# Altium schematic sheet Main.SchDoc (part 1 of 2)
size A1
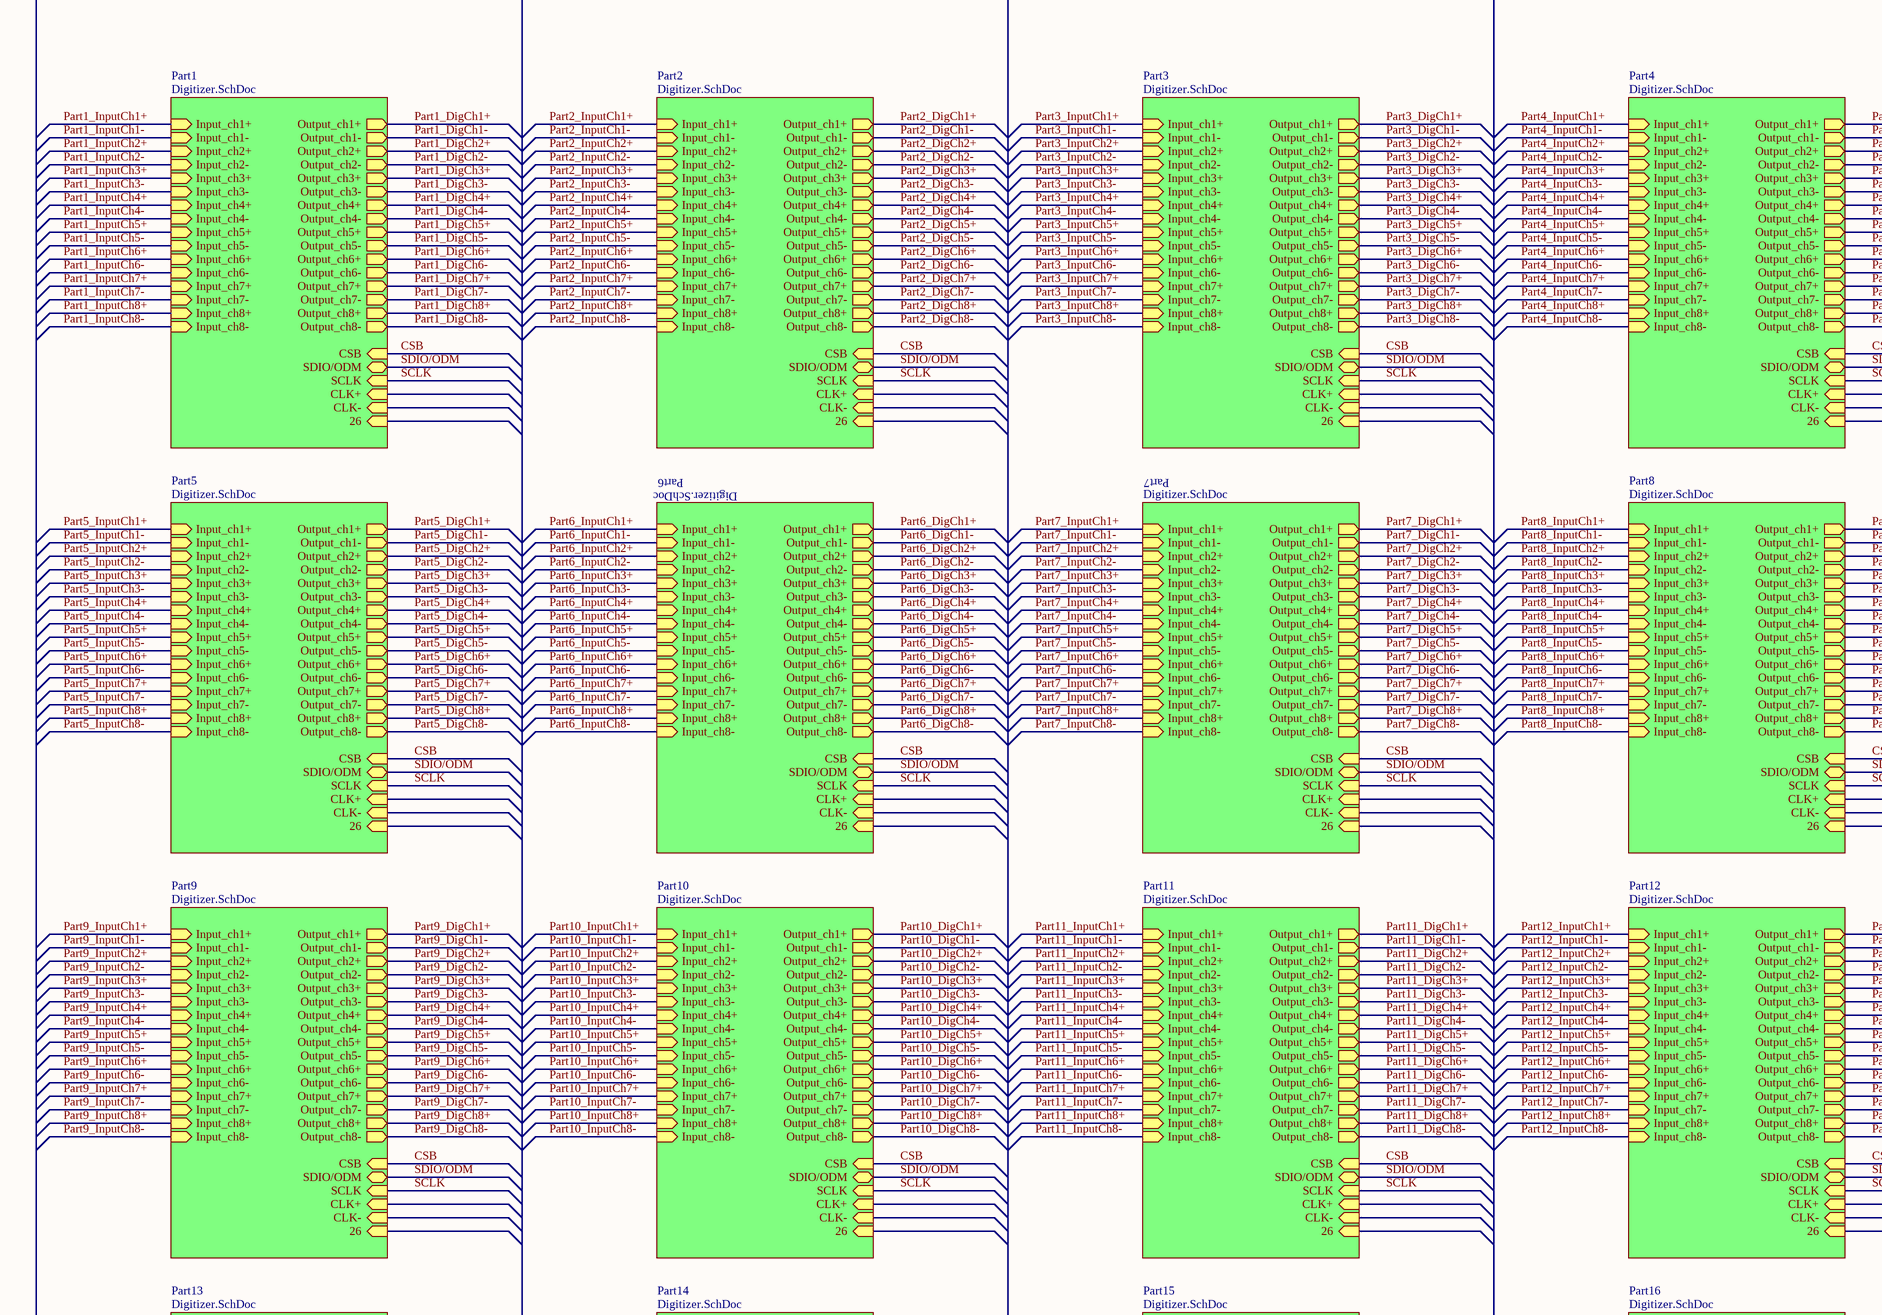
[diagram p0: Main.SchDoc, top left]
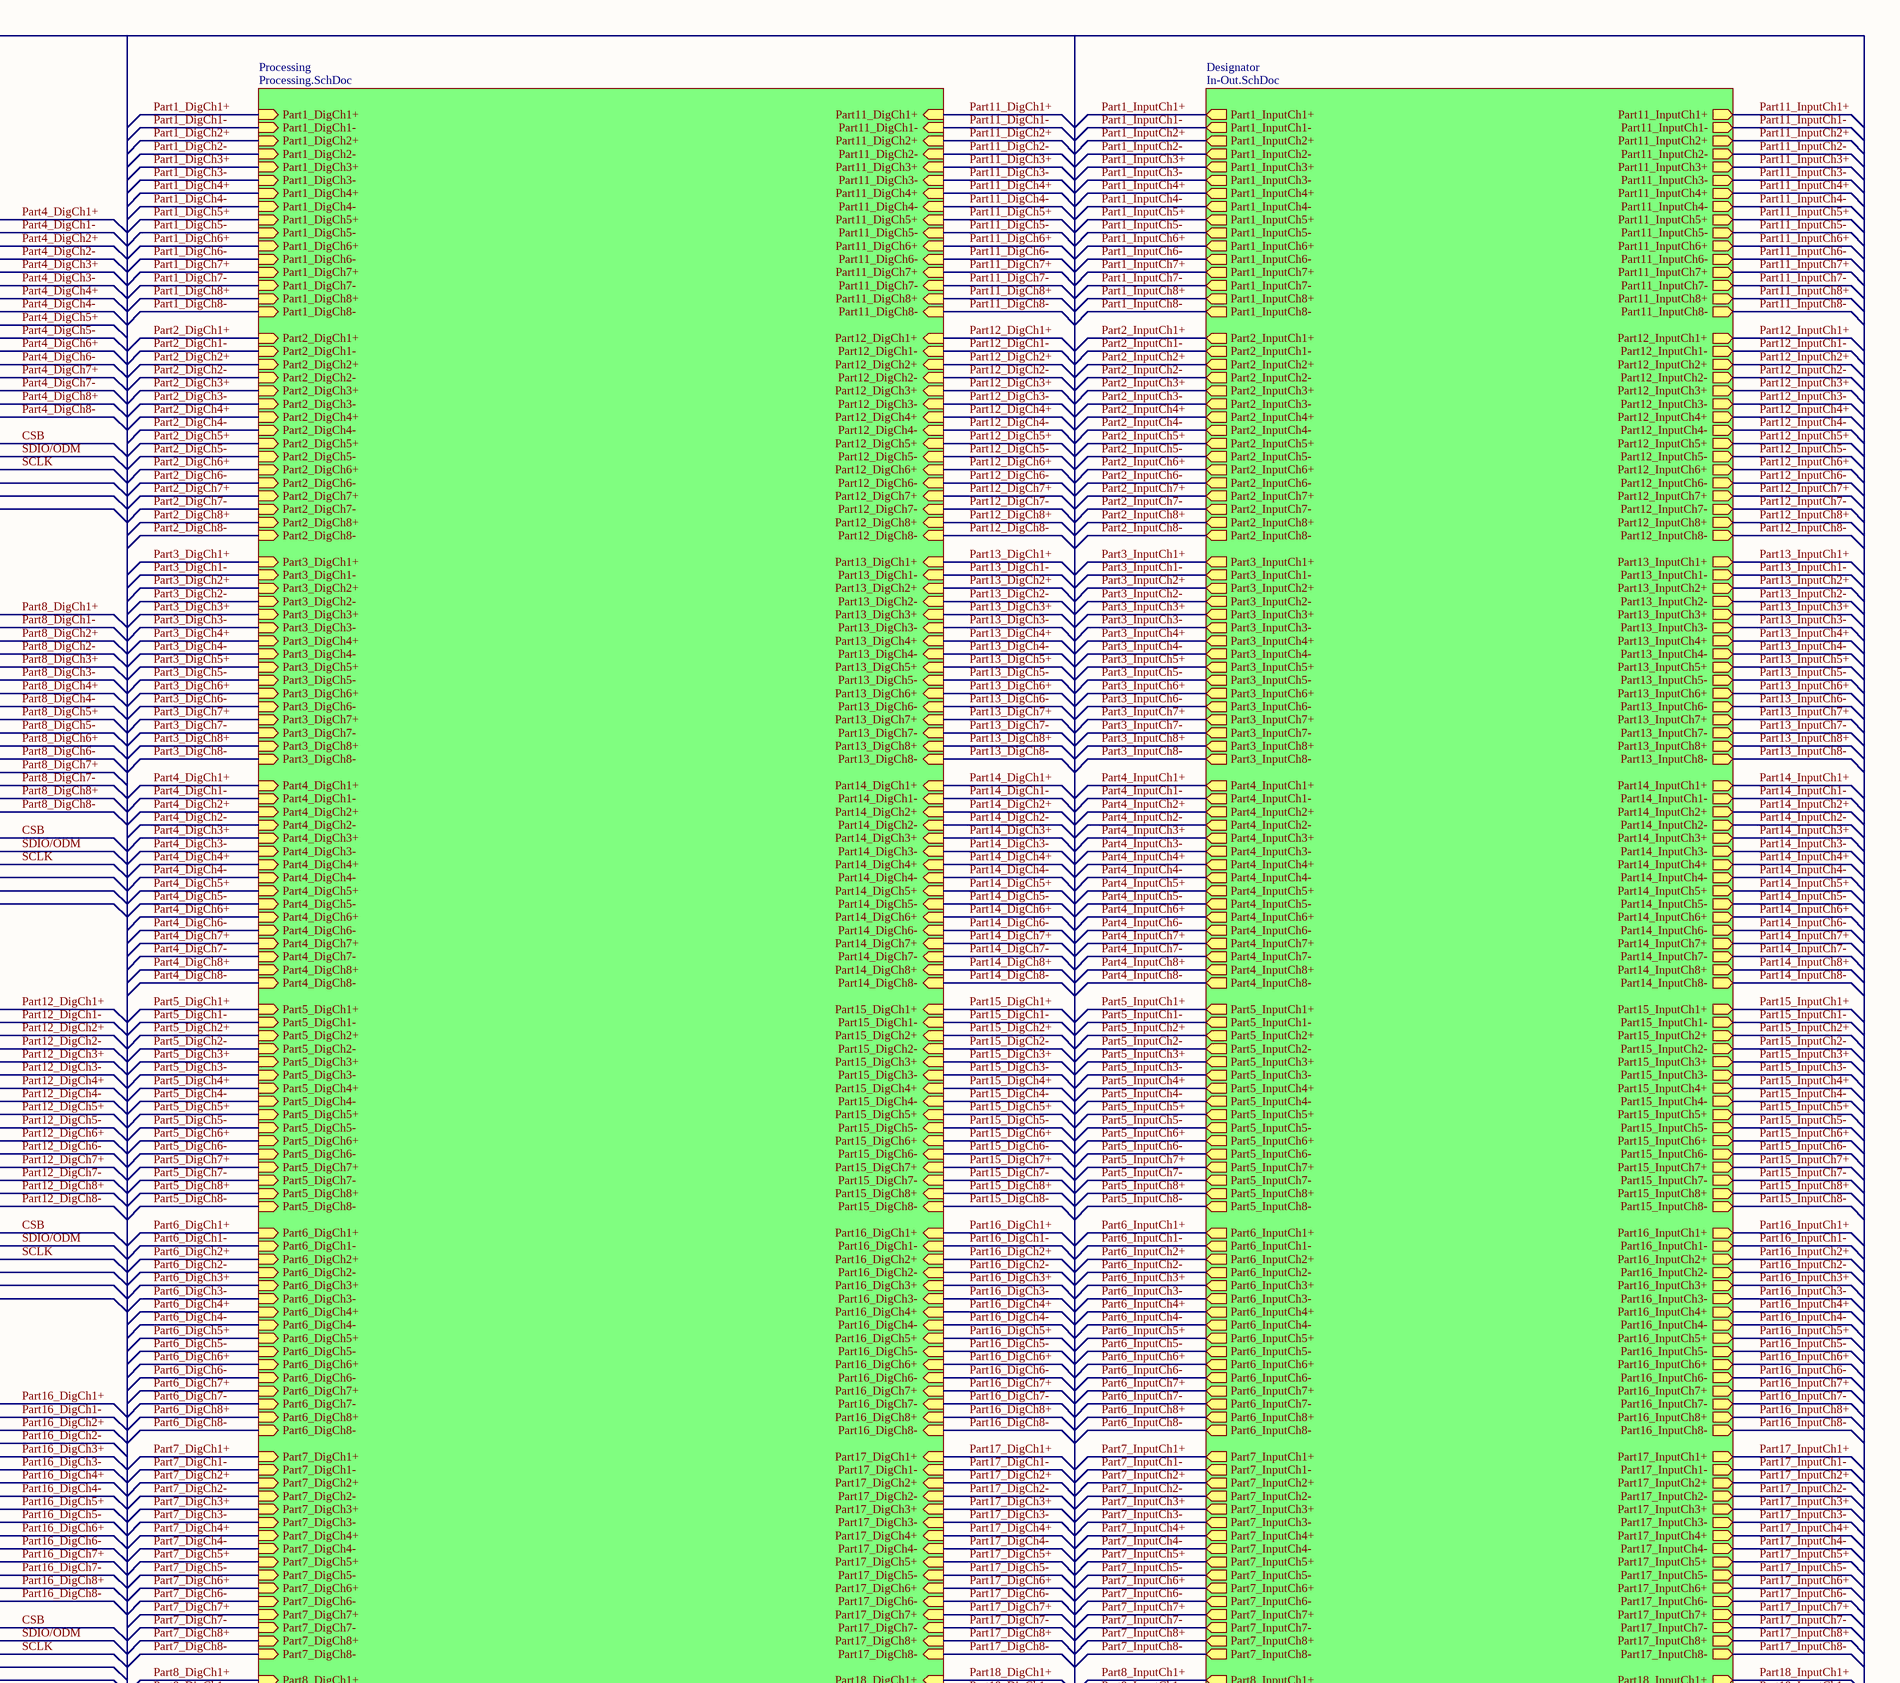
[diagram p1: Main.SchDoc, top right]
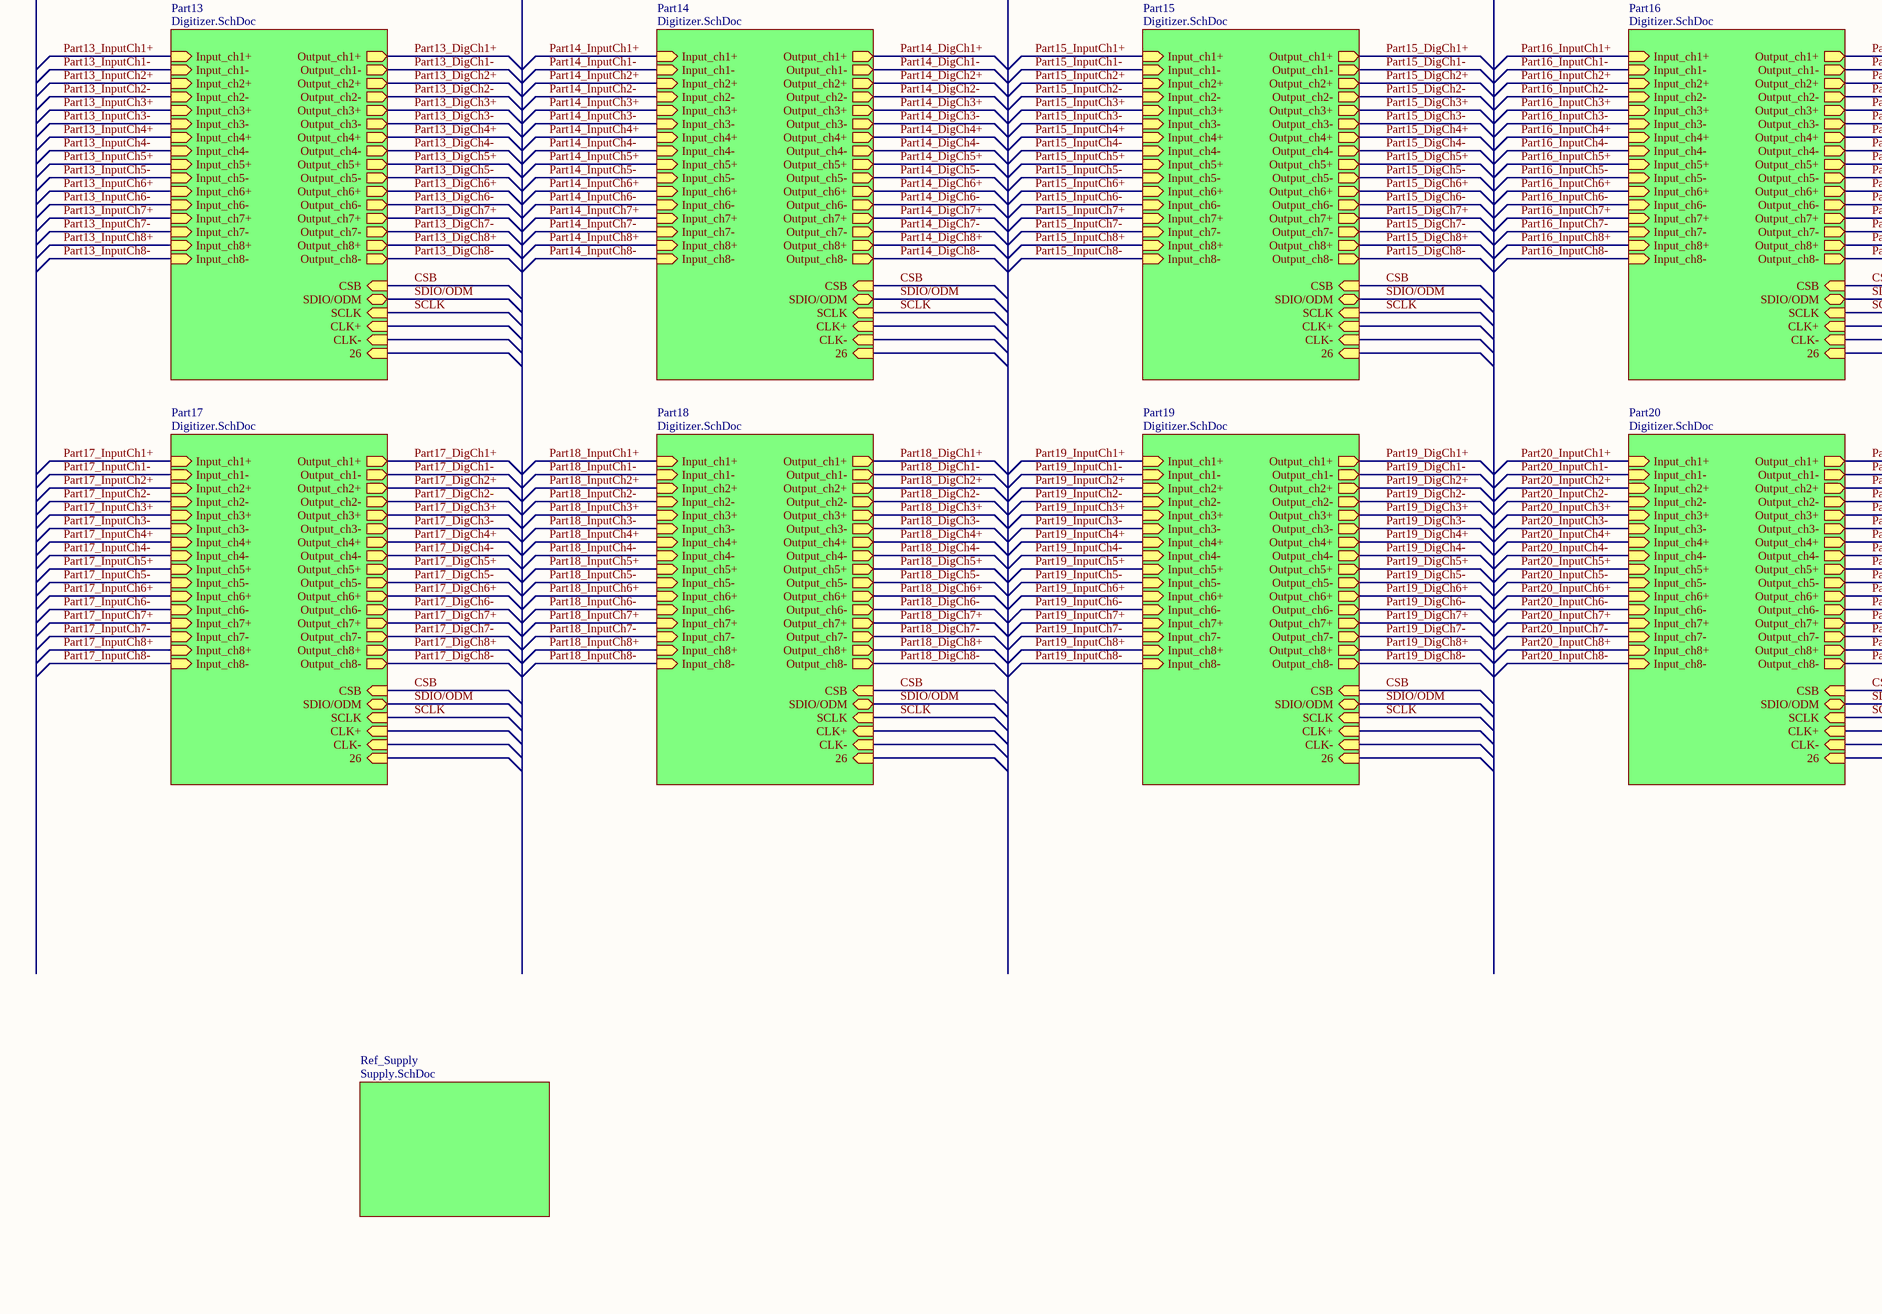
[diagram p2: Main.SchDoc, bottom left]
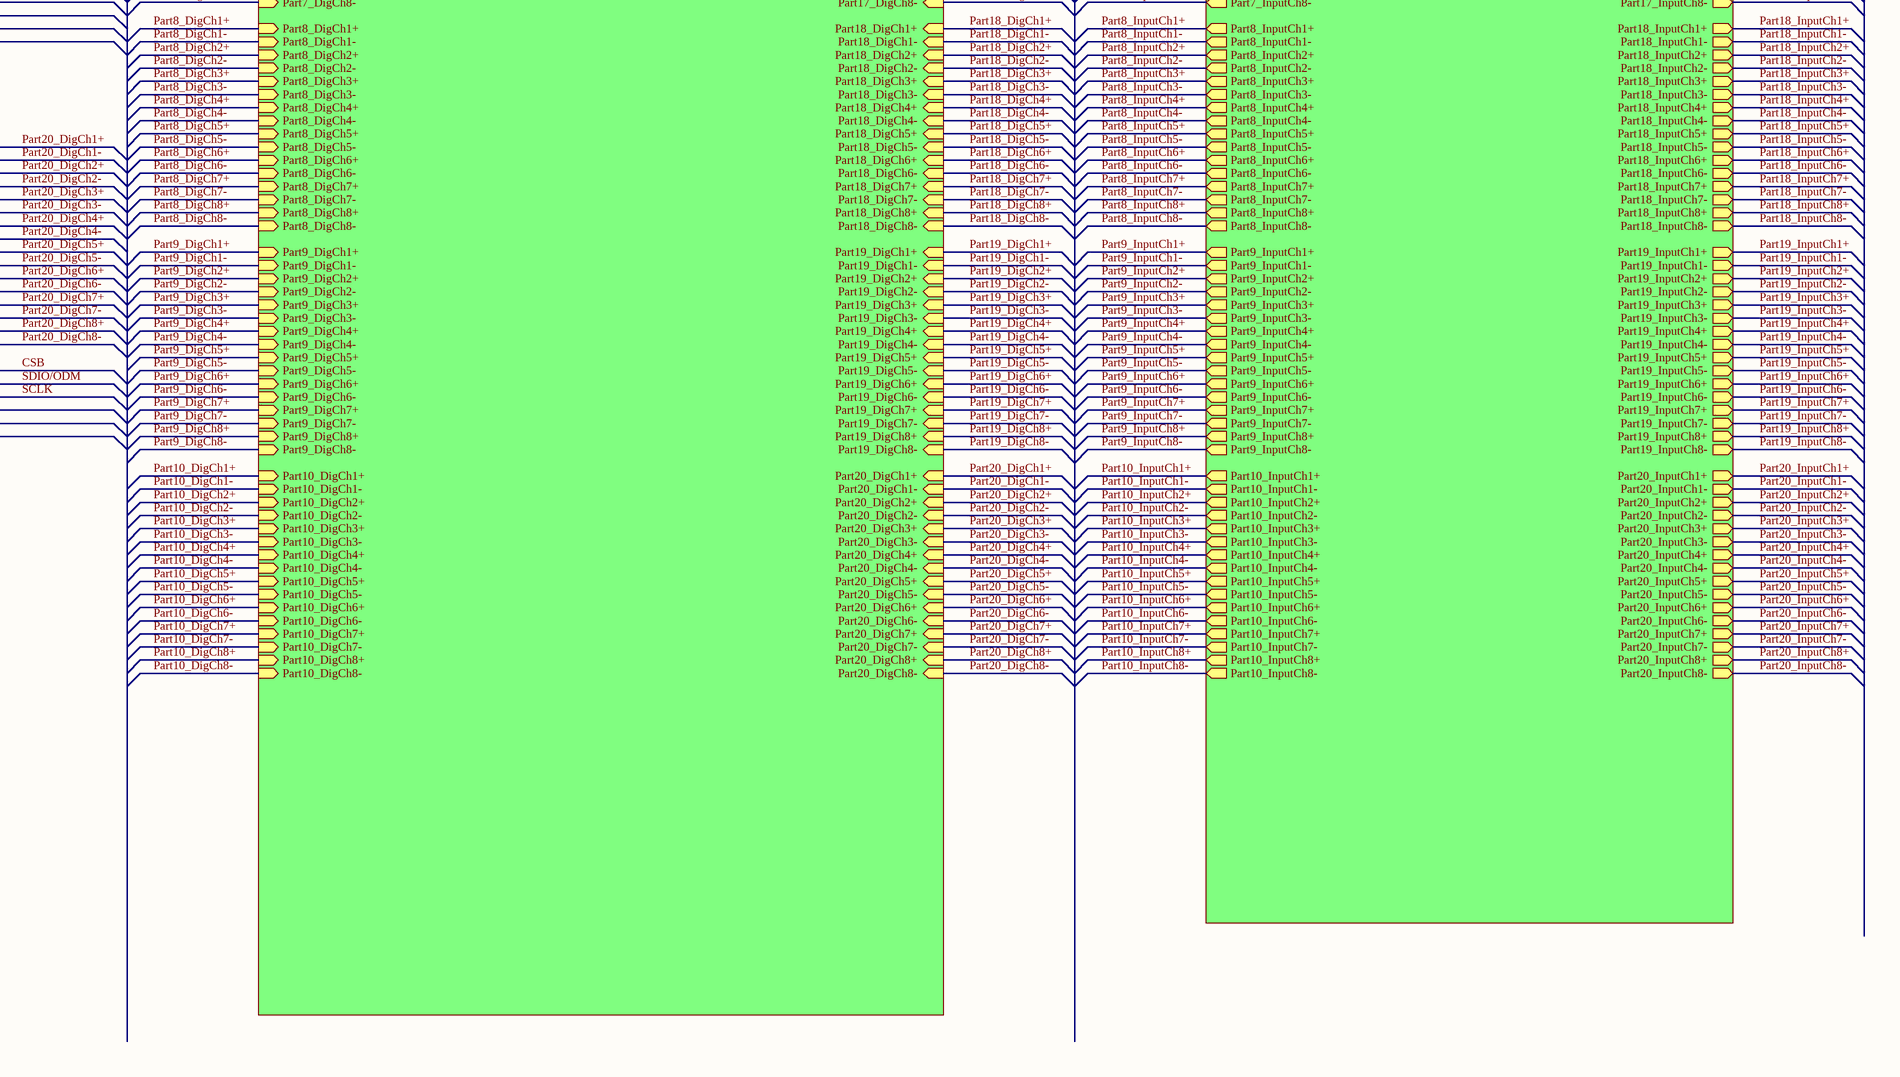
[diagram p3: Main.SchDoc, bottom right]

## Sub-sheets
Designator = In-Out.SchDoc: Part1_InputCh1+ (out), Part1_InputCh1- (out), Part1_InputCh2+ (out), Part1_InputCh2- (out), Part1_InputCh3+ (out), Part1_InputCh3- (out), Part1_InputCh4+ (out), Part1_InputCh4- (out), Part1_InputCh5+ (out), Part1_InputCh5- (out), Part1_InputCh6+ (out), Part1_InputCh6- (out), Part1_InputCh7+ (out), Part1_InputCh7- (out), Part1_InputCh8+ (out), Part1_InputCh8- (out), Part2_InputCh1+ (out), Part2_InputCh1- (out), Part2_InputCh2+ (out), Part2_InputCh2- (out), Part2_InputCh3+ (out), Part2_InputCh3- (out), Part2_InputCh4+ (out), Part2_InputCh4- (out), Part2_InputCh5+ (out), Part2_InputCh5- (out), Part2_InputCh6+ (out), Part2_InputCh6- (out), Part2_InputCh7+ (out), Part2_InputCh7- (out), Part2_InputCh8+ (out), Part2_InputCh8- (out), Part3_InputCh1+ (out), Part3_InputCh1- (out), Part3_InputCh2+ (out), Part3_InputCh2- (out), Part3_InputCh3+ (out), Part3_InputCh3- (out), Part3_InputCh4+ (out), Part3_InputCh4- (out), Part3_InputCh5+ (out), Part3_InputCh5- (out), Part3_InputCh6+ (out), Part3_InputCh6- (out), Part3_InputCh7+ (out), Part3_InputCh7- (out), Part3_InputCh8+ (out), Part3_InputCh8- (out), Part4_InputCh1+ (out), Part4_InputCh1- (out), Part4_InputCh2+ (out), Part4_InputCh2- (out), Part4_InputCh3+ (out), Part4_InputCh3- (out), Part4_InputCh4+ (out), Part4_InputCh4- (out), Part4_InputCh5+ (out), Part4_InputCh5- (out), Part4_InputCh6+ (out), Part4_InputCh6- (out), Part4_InputCh7+ (out), Part4_InputCh7- (out), Part4_InputCh8+ (out), Part4_InputCh8- (out), Part5_InputCh1+ (out), Part5_InputCh1- (out), Part5_InputCh2+ (out), Part5_InputCh2- (out), Part5_InputCh3+ (out), Part5_InputCh3- (out), Part5_InputCh4+ (out), Part5_InputCh4- (out), Part5_InputCh5+ (out), Part5_InputCh5- (out), Part5_InputCh6+ (out), Part5_InputCh6- (out), Part5_InputCh7+ (out), Part5_InputCh7- (out), Part5_InputCh8+ (out), Part5_InputCh8- (out), Part6_InputCh1+ (out), Part6_InputCh1- (out), Part6_InputCh2+ (out), Part6_InputCh2- (out), Part6_InputCh3+ (out), Part6_InputCh3- (out), Part6_InputCh4+ (out), Part6_InputCh4- (out), Part6_InputCh5+ (out), Part6_InputCh5- (out), Part6_InputCh6+ (out), Part6_InputCh6- (out), Part6_InputCh7+ (out), Part6_InputCh7- (out), Part6_InputCh8+ (out), Part6_InputCh8- (out), Part7_InputCh1+ (out), Part7_InputCh1- (out), Part7_InputCh2+ (out), Part7_InputCh2- (out), Part7_InputCh3+ (out), Part7_InputCh3- (out), Part7_InputCh4+ (out), Part7_InputCh4- (out), Part7_InputCh5+ (out), Part7_InputCh5- (out), Part7_InputCh6+ (out), Part7_InputCh6- (out), Part7_InputCh7+ (out), Part7_InputCh7- (out), Part7_InputCh8+ (out), Part7_InputCh8- (out), Part8_InputCh1+ (out), Part8_InputCh1- (out), Part8_InputCh2+ (out), Part8_InputCh2- (out), Part8_InputCh3+ (out), Part8_InputCh3- (out), Part8_InputCh4+ (out), Part8_InputCh4- (out), Part8_InputCh5+ (out), Part8_InputCh5- (out), Part8_InputCh6+ (out), Part8_InputCh6- (out), Part8_InputCh7+ (out), Part8_InputCh7- (out), Part8_InputCh8+ (out), Part8_InputCh8- (out), Part9_InputCh1+ (out), Part9_InputCh1- (out), Part9_InputCh2+ (out), Part9_InputCh2- (out), Part9_InputCh3+ (out), Part9_InputCh3- (out), Part9_InputCh4+ (out), Part9_InputCh4- (out), Part9_InputCh5+ (out), Part9_InputCh5- (out), Part9_InputCh6+ (out), Part9_InputCh6- (out), Part9_InputCh7+ (out), Part9_InputCh7- (out), Part9_InputCh8+ (out), Part9_InputCh8- (out), Part10_InputCh1+ (out), Part10_InputCh1- (out), Part10_InputCh2+ (out), Part10_InputCh2- (out), Part10_InputCh3+ (out), Part10_InputCh3- (out), Part10_InputCh4+ (out), Part10_InputCh4- (out), Part10_InputCh5+ (out), Part10_InputCh5- (out), Part10_InputCh6+ (out), Part10_InputCh6- (out), Part10_InputCh7+ (out), Part10_InputCh7- (out), Part10_InputCh8+ (out), Part10_InputCh8- (out), Part11_InputCh1+ (out), Part11_InputCh1- (out), Part11_InputCh2+ (out), Part11_InputCh2- (out), Part11_InputCh3+ (out), Part11_InputCh3- (out), Part11_InputCh4+ (out), Part11_InputCh4- (out), Part11_InputCh5+ (out), Part11_InputCh5- (out), Part11_InputCh6+ (out), Part11_InputCh6- (out), Part11_InputCh7+ (out), Part11_InputCh7- (out), Part11_InputCh8+ (out), Part11_InputCh8- (out), Part12_InputCh1+ (out), Part12_InputCh1- (out), Part12_InputCh2+ (out), Part12_InputCh2- (out), Part12_InputCh3+ (out), Part12_InputCh3- (out), Part12_InputCh4+ (out), Part12_InputCh4- (out), Part12_InputCh5+ (out), Part12_InputCh5- (out), Part12_InputCh6+ (out), Part12_InputCh6- (out), Part12_InputCh7+ (out), Part12_InputCh7- (out), Part12_InputCh8+ (out), Part12_InputCh8- (out), Part13_InputCh1+ (out), Part13_InputCh1- (out), Part13_InputCh2+ (out), Part13_InputCh2- (out), Part13_InputCh3+ (out), Part13_InputCh3- (out), Part13_InputCh4+ (out), Part13_InputCh4- (out), Part13_InputCh5+ (out), Part13_InputCh5- (out), Part13_InputCh6+ (out), Part13_InputCh6- (out), Part13_InputCh7+ (out), Part13_InputCh7- (out), Part13_InputCh8+ (out), Part13_InputCh8- (out), Part14_InputCh1+ (out), Part14_InputCh1- (out), Part14_InputCh2+ (out), Part14_InputCh2- (out), Part14_InputCh3+ (out), Part14_InputCh3- (out), Part14_InputCh4+ (out), Part14_InputCh4- (out), Part14_InputCh5+ (out), Part14_InputCh5- (out), Part14_InputCh6+ (out), Part14_InputCh6- (out), Part14_InputCh7+ (out), Part14_InputCh7- (out), Part14_InputCh8+ (out), Part14_InputCh8- (out), Part15_InputCh1+ (out), Part15_InputCh1- (out), Part15_InputCh2+ (out), Part15_InputCh2- (out), Part15_InputCh3+ (out), Part15_InputCh3- (out), Part15_InputCh4+ (out), Part15_InputCh4- (out), Part15_InputCh5+ (out), Part15_InputCh5- (out), Part15_InputCh6+ (out), Part15_InputCh6- (out), Part15_InputCh7+ (out), Part15_InputCh7- (out), Part15_InputCh8+ (out), Part15_InputCh8- (out), Part16_InputCh1+ (out), Part16_InputCh1- (out), Part16_InputCh2+ (out), Part16_InputCh2- (out), Part16_InputCh3+ (out), Part16_InputCh3- (out), Part16_InputCh4+ (out), Part16_InputCh4- (out), Part16_InputCh5+ (out), Part16_InputCh5- (out), Part16_InputCh6+ (out), Part16_InputCh6- (out), Part16_InputCh7+ (out), Part16_InputCh7- (out), Part16_InputCh8+ (out), Part16_InputCh8- (out), Part17_InputCh1+ (out), Part17_InputCh1- (out), Part17_InputCh2+ (out), Part17_InputCh2- (out), Part17_InputCh3+ (out), Part17_InputCh3- (out), Part17_InputCh4+ (out), Part17_InputCh4- (out), Part17_InputCh5+ (out), Part17_InputCh5- (out), Part17_InputCh6+ (out), Part17_InputCh6- (out), Part17_InputCh7+ (out), Part17_InputCh7- (out), Part17_InputCh8+ (out), Part17_InputCh8- (out), Part18_InputCh1+ (out), Part18_InputCh1- (out), Part18_InputCh2+ (out), Part18_InputCh2- (out), Part18_InputCh3+ (out), Part18_InputCh3- (out), Part18_InputCh4+ (out), Part18_InputCh4- (out), Part18_InputCh5+ (out), Part18_InputCh5- (out), Part18_InputCh6+ (out), Part18_InputCh6- (out), Part18_InputCh7+ (out), Part18_InputCh7- (out), Part18_InputCh8+ (out), Part18_InputCh8- (out), Part19_InputCh1+ (out), Part19_InputCh1- (out), Part19_InputCh2+ (out), Part19_InputCh2- (out), Part19_InputCh3+ (out), Part19_InputCh3- (out), Part19_InputCh4+ (out), Part19_InputCh4- (out), Part19_InputCh5+ (out), Part19_InputCh5- (out), Part19_InputCh6+ (out), Part19_InputCh6- (out), Part19_InputCh7+ (out), Part19_InputCh7- (out), Part19_InputCh8+ (out), Part19_InputCh8- (out), Part20_InputCh1+ (out), Part20_InputCh1- (out), Part20_InputCh2+ (out), Part20_InputCh2- (out), Part20_InputCh3+ (out), Part20_InputCh3- (out), Part20_InputCh4+ (out), Part20_InputCh4- (out), Part20_InputCh5+ (out), Part20_InputCh5- (out), Part20_InputCh6+ (out), Part20_InputCh6- (out), Part20_InputCh7+ (out), Part20_InputCh7- (out), Part20_InputCh8+ (out), Part20_InputCh8- (out)
Part1 = Digitizer.SchDoc: Output_ch1+ (out), Output_ch1- (out), Output_ch2+ (out), Output_ch2- (out), Output_ch3+ (out), Output_ch3- (out), Output_ch4+ (out), Output_ch4- (out), Output_ch5+ (out), Output_ch5- (out), Output_ch6+ (out), Output_ch6- (out), Output_ch7+ (out), Output_ch7- (out), Output_ch8+ (out), Output_ch8- (out), Input_ch1+ (in), Input_ch1- (in), Input_ch2+ (in), Input_ch2- (in), Input_ch3+ (in), Input_ch3- (in), Input_ch4+ (in), Input_ch4- (in), Input_ch5+ (in), Input_ch5- (in), Input_ch6+ (in), Input_ch6- (in), Input_ch7+ (in), Input_ch7- (in), Input_ch8+ (in), Input_ch8- (in), CSB (in), SDIO/ODM (bidir), SCLK (in), CLK+ (in), CLK- (in), 26 (in)
Part2 = Digitizer.SchDoc: Output_ch1+ (out), Output_ch1- (out), Output_ch2+ (out), Output_ch2- (out), Output_ch3+ (out), Output_ch3- (out), Output_ch4+ (out), Output_ch4- (out), Output_ch5+ (out), Output_ch5- (out), Output_ch6+ (out), Output_ch6- (out), Output_ch7+ (out), Output_ch7- (out), Output_ch8+ (out), Output_ch8- (out), Input_ch1+ (in), Input_ch1- (in), Input_ch2+ (in), Input_ch2- (in), Input_ch3+ (in), Input_ch3- (in), Input_ch4+ (in), Input_ch4- (in), Input_ch5+ (in), Input_ch5- (in), Input_ch6+ (in), Input_ch6- (in), Input_ch7+ (in), Input_ch7- (in), Input_ch8+ (in), Input_ch8- (in), CSB (in), SDIO/ODM (bidir), SCLK (in), CLK+ (in), CLK- (in), 26 (in)
Part3 = Digitizer.SchDoc: Output_ch1+ (out), Output_ch1- (out), Output_ch2+ (out), Output_ch2- (out), Output_ch3+ (out), Output_ch3- (out), Output_ch4+ (out), Output_ch4- (out), Output_ch5+ (out), Output_ch5- (out), Output_ch6+ (out), Output_ch6- (out), Output_ch7+ (out), Output_ch7- (out), Output_ch8+ (out), Output_ch8- (out), Input_ch1+ (in), Input_ch1- (in), Input_ch2+ (in), Input_ch2- (in), Input_ch3+ (in), Input_ch3- (in), Input_ch4+ (in), Input_ch4- (in), Input_ch5+ (in), Input_ch5- (in), Input_ch6+ (in), Input_ch6- (in), Input_ch7+ (in), Input_ch7- (in), Input_ch8+ (in), Input_ch8- (in), CSB (in), SDIO/ODM (bidir), SCLK (in), CLK+ (in), CLK- (in), 26 (in)
Part4 = Digitizer.SchDoc: Output_ch1+ (out), Output_ch1- (out), Output_ch2+ (out), Output_ch2- (out), Output_ch3+ (out), Output_ch3- (out), Output_ch4+ (out), Output_ch4- (out), Output_ch5+ (out), Output_ch5- (out), Output_ch6+ (out), Output_ch6- (out), Output_ch7+ (out), Output_ch7- (out), Output_ch8+ (out), Output_ch8- (out), Input_ch1+ (in), Input_ch1- (in), Input_ch2+ (in), Input_ch2- (in), Input_ch3+ (in), Input_ch3- (in), Input_ch4+ (in), Input_ch4- (in), Input_ch5+ (in), Input_ch5- (in), Input_ch6+ (in), Input_ch6- (in), Input_ch7+ (in), Input_ch7- (in), Input_ch8+ (in), Input_ch8- (in), CSB (in), SDIO/ODM (bidir), SCLK (in), CLK+ (in), CLK- (in), 26 (in)
Part5 = Digitizer.SchDoc: Output_ch1+ (out), Output_ch1- (out), Output_ch2+ (out), Output_ch2- (out), Output_ch3+ (out), Output_ch3- (out), Output_ch4+ (out), Output_ch4- (out), Output_ch5+ (out), Output_ch5- (out), Output_ch6+ (out), Output_ch6- (out), Output_ch7+ (out), Output_ch7- (out), Output_ch8+ (out), Output_ch8- (out), Input_ch1+ (in), Input_ch1- (in), Input_ch2+ (in), Input_ch2- (in), Input_ch3+ (in), Input_ch3- (in), Input_ch4+ (in), Input_ch4- (in), Input_ch5+ (in), Input_ch5- (in), Input_ch6+ (in), Input_ch6- (in), Input_ch7+ (in), Input_ch7- (in), Input_ch8+ (in), Input_ch8- (in), CSB (in), SDIO/ODM (bidir), SCLK (in), CLK+ (in), CLK- (in), 26 (in)
Part6 = Digitizer.SchDoc: Output_ch1+ (out), Output_ch1- (out), Output_ch2+ (out), Output_ch2- (out), Output_ch3+ (out), Output_ch3- (out), Output_ch4+ (out), Output_ch4- (out), Output_ch5+ (out), Output_ch5- (out), Output_ch6+ (out), Output_ch6- (out), Output_ch7+ (out), Output_ch7- (out), Output_ch8+ (out), Output_ch8- (out), Input_ch1+ (in), Input_ch1- (in), Input_ch2+ (in), Input_ch2- (in), Input_ch3+ (in), Input_ch3- (in), Input_ch4+ (in), Input_ch4- (in), Input_ch5+ (in), Input_ch5- (in), Input_ch6+ (in), Input_ch6- (in), Input_ch7+ (in), Input_ch7- (in), Input_ch8+ (in), Input_ch8- (in), CSB (in), SDIO/ODM (bidir), SCLK (in), CLK+ (in), CLK- (in), 26 (in)
Part7 = Digitizer.SchDoc: Output_ch1+ (out), Output_ch1- (out), Output_ch2+ (out), Output_ch2- (out), Output_ch3+ (out), Output_ch3- (out), Output_ch4+ (out), Output_ch4- (out), Output_ch5+ (out), Output_ch5- (out), Output_ch6+ (out), Output_ch6- (out), Output_ch7+ (out), Output_ch7- (out), Output_ch8+ (out), Output_ch8- (out), Input_ch1+ (in), Input_ch1- (in), Input_ch2+ (in), Input_ch2- (in), Input_ch3+ (in), Input_ch3- (in), Input_ch4+ (in), Input_ch4- (in), Input_ch5+ (in), Input_ch5- (in), Input_ch6+ (in), Input_ch6- (in), Input_ch7+ (in), Input_ch7- (in), Input_ch8+ (in), Input_ch8- (in), CSB (in), SDIO/ODM (bidir), SCLK (in), CLK+ (in), CLK- (in), 26 (in)
Part8 = Digitizer.SchDoc: Output_ch1+ (out), Output_ch1- (out), Output_ch2+ (out), Output_ch2- (out), Output_ch3+ (out), Output_ch3- (out), Output_ch4+ (out), Output_ch4- (out), Output_ch5+ (out), Output_ch5- (out), Output_ch6+ (out), Output_ch6- (out), Output_ch7+ (out), Output_ch7- (out), Output_ch8+ (out), Output_ch8- (out), Input_ch1+ (in), Input_ch1- (in), Input_ch2+ (in), Input_ch2- (in), Input_ch3+ (in), Input_ch3- (in), Input_ch4+ (in), Input_ch4- (in), Input_ch5+ (in), Input_ch5- (in), Input_ch6+ (in), Input_ch6- (in), Input_ch7+ (in), Input_ch7- (in), Input_ch8+ (in), Input_ch8- (in), CSB (in), SDIO/ODM (bidir), SCLK (in), CLK+ (in), CLK- (in), 26 (in)
Part9 = Digitizer.SchDoc: Output_ch1+ (out), Output_ch1- (out), Output_ch2+ (out), Output_ch2- (out), Output_ch3+ (out), Output_ch3- (out), Output_ch4+ (out), Output_ch4- (out), Output_ch5+ (out), Output_ch5- (out), Output_ch6+ (out), Output_ch6- (out), Output_ch7+ (out), Output_ch7- (out), Output_ch8+ (out), Output_ch8- (out), Input_ch1+ (in), Input_ch1- (in), Input_ch2+ (in), Input_ch2- (in), Input_ch3+ (in), Input_ch3- (in), Input_ch4+ (in), Input_ch4- (in), Input_ch5+ (in), Input_ch5- (in), Input_ch6+ (in), Input_ch6- (in), Input_ch7+ (in), Input_ch7- (in), Input_ch8+ (in), Input_ch8- (in), CSB (in), SDIO/ODM (bidir), SCLK (in), CLK+ (in), CLK- (in), 26 (in)
Part10 = Digitizer.SchDoc: Output_ch1+ (out), Output_ch1- (out), Output_ch2+ (out), Output_ch2- (out), Output_ch3+ (out), Output_ch3- (out), Output_ch4+ (out), Output_ch4- (out), Output_ch5+ (out), Output_ch5- (out), Output_ch6+ (out), Output_ch6- (out), Output_ch7+ (out), Output_ch7- (out), Output_ch8+ (out), Output_ch8- (out), Input_ch1+ (in), Input_ch1- (in), Input_ch2+ (in), Input_ch2- (in), Input_ch3+ (in), Input_ch3- (in), Input_ch4+ (in), Input_ch4- (in), Input_ch5+ (in), Input_ch5- (in), Input_ch6+ (in), Input_ch6- (in), Input_ch7+ (in), Input_ch7- (in), Input_ch8+ (in), Input_ch8- (in), CSB (in), SDIO/ODM (bidir), SCLK (in), CLK+ (in), CLK- (in), 26 (in)
Part11 = Digitizer.SchDoc: Output_ch1+ (out), Output_ch1- (out), Output_ch2+ (out), Output_ch2- (out), Output_ch3+ (out), Output_ch3- (out), Output_ch4+ (out), Output_ch4- (out), Output_ch5+ (out), Output_ch5- (out), Output_ch6+ (out), Output_ch6- (out), Output_ch7+ (out), Output_ch7- (out), Output_ch8+ (out), Output_ch8- (out), Input_ch1+ (in), Input_ch1- (in), Input_ch2+ (in), Input_ch2- (in), Input_ch3+ (in), Input_ch3- (in), Input_ch4+ (in), Input_ch4- (in), Input_ch5+ (in), Input_ch5- (in), Input_ch6+ (in), Input_ch6- (in), Input_ch7+ (in), Input_ch7- (in), Input_ch8+ (in), Input_ch8- (in), CSB (in), SDIO/ODM (bidir), SCLK (in), CLK+ (in), CLK- (in), 26 (in)
Part12 = Digitizer.SchDoc: Output_ch1+ (out), Output_ch1- (out), Output_ch2+ (out), Output_ch2- (out), Output_ch3+ (out), Output_ch3- (out), Output_ch4+ (out), Output_ch4- (out), Output_ch5+ (out), Output_ch5- (out), Output_ch6+ (out), Output_ch6- (out), Output_ch7+ (out), Output_ch7- (out), Output_ch8+ (out), Output_ch8- (out), Input_ch1+ (in), Input_ch1- (in), Input_ch2+ (in), Input_ch2- (in), Input_ch3+ (in), Input_ch3- (in), Input_ch4+ (in), Input_ch4- (in), Input_ch5+ (in), Input_ch5- (in), Input_ch6+ (in), Input_ch6- (in), Input_ch7+ (in), Input_ch7- (in), Input_ch8+ (in), Input_ch8- (in), CSB (in), SDIO/ODM (bidir), SCLK (in), CLK+ (in), CLK- (in), 26 (in)
Part13 = Digitizer.SchDoc: Output_ch1+ (out), Output_ch1- (out), Output_ch2+ (out), Output_ch2- (out), Output_ch3+ (out), Output_ch3- (out), Output_ch4+ (out), Output_ch4- (out), Output_ch5+ (out), Output_ch5- (out), Output_ch6+ (out), Output_ch6- (out), Output_ch7+ (out), Output_ch7- (out), Output_ch8+ (out), Output_ch8- (out), Input_ch1+ (in), Input_ch1- (in), Input_ch2+ (in), Input_ch2- (in), Input_ch3+ (in), Input_ch3- (in), Input_ch4+ (in), Input_ch4- (in), Input_ch5+ (in), Input_ch5- (in), Input_ch6+ (in), Input_ch6- (in), Input_ch7+ (in), Input_ch7- (in), Input_ch8+ (in), Input_ch8- (in), CSB (in), SDIO/ODM (bidir), SCLK (in), CLK+ (in), CLK- (in), 26 (in)
Part14 = Digitizer.SchDoc: Output_ch1+ (out), Output_ch1- (out), Output_ch2+ (out), Output_ch2- (out), Output_ch3+ (out), Output_ch3- (out), Output_ch4+ (out), Output_ch4- (out), Output_ch5+ (out), Output_ch5- (out), Output_ch6+ (out), Output_ch6- (out), Output_ch7+ (out), Output_ch7- (out), Output_ch8+ (out), Output_ch8- (out), Input_ch1+ (in), Input_ch1- (in), Input_ch2+ (in), Input_ch2- (in), Input_ch3+ (in), Input_ch3- (in), Input_ch4+ (in), Input_ch4- (in), Input_ch5+ (in), Input_ch5- (in), Input_ch6+ (in), Input_ch6- (in), Input_ch7+ (in), Input_ch7- (in), Input_ch8+ (in), Input_ch8- (in), CSB (in), SDIO/ODM (bidir), SCLK (in), CLK+ (in), CLK- (in), 26 (in)
Part15 = Digitizer.SchDoc: Output_ch1+ (out), Output_ch1- (out), Output_ch2+ (out), Output_ch2- (out), Output_ch3+ (out), Output_ch3- (out), Output_ch4+ (out), Output_ch4- (out), Output_ch5+ (out), Output_ch5- (out), Output_ch6+ (out), Output_ch6- (out), Output_ch7+ (out), Output_ch7- (out), Output_ch8+ (out), Output_ch8- (out), Input_ch1+ (in), Input_ch1- (in), Input_ch2+ (in), Input_ch2- (in), Input_ch3+ (in), Input_ch3- (in), Input_ch4+ (in), Input_ch4- (in), Input_ch5+ (in), Input_ch5- (in), Input_ch6+ (in), Input_ch6- (in), Input_ch7+ (in), Input_ch7- (in), Input_ch8+ (in), Input_ch8- (in), CSB (in), SDIO/ODM (bidir), SCLK (in), CLK+ (in), CLK- (in), 26 (in)
Part16 = Digitizer.SchDoc: Output_ch1+ (out), Output_ch1- (out), Output_ch2+ (out), Output_ch2- (out), Output_ch3+ (out), Output_ch3- (out), Output_ch4+ (out), Output_ch4- (out), Output_ch5+ (out), Output_ch5- (out), Output_ch6+ (out), Output_ch6- (out), Output_ch7+ (out), Output_ch7- (out), Output_ch8+ (out), Output_ch8- (out), Input_ch1+ (in), Input_ch1- (in), Input_ch2+ (in), Input_ch2- (in), Input_ch3+ (in), Input_ch3- (in), Input_ch4+ (in), Input_ch4- (in), Input_ch5+ (in), Input_ch5- (in), Input_ch6+ (in), Input_ch6- (in), Input_ch7+ (in), Input_ch7- (in), Input_ch8+ (in), Input_ch8- (in), CSB (in), SDIO/ODM (bidir), SCLK (in), CLK+ (in), CLK- (in), 26 (in)
Part17 = Digitizer.SchDoc: Output_ch1+ (out), Output_ch1- (out), Output_ch2+ (out), Output_ch2- (out), Output_ch3+ (out), Output_ch3- (out), Output_ch4+ (out), Output_ch4- (out), Output_ch5+ (out), Output_ch5- (out), Output_ch6+ (out), Output_ch6- (out), Output_ch7+ (out), Output_ch7- (out), Output_ch8+ (out), Output_ch8- (out), Input_ch1+ (in), Input_ch1- (in), Input_ch2+ (in), Input_ch2- (in), Input_ch3+ (in), Input_ch3- (in), Input_ch4+ (in), Input_ch4- (in), Input_ch5+ (in), Input_ch5- (in), Input_ch6+ (in), Input_ch6- (in), Input_ch7+ (in), Input_ch7- (in), Input_ch8+ (in), Input_ch8- (in), CSB (in), SDIO/ODM (bidir), SCLK (in), CLK+ (in), CLK- (in), 26 (in)
Part18 = Digitizer.SchDoc: Output_ch1+ (out), Output_ch1- (out), Output_ch2+ (out), Output_ch2- (out), Output_ch3+ (out), Output_ch3- (out), Output_ch4+ (out), Output_ch4- (out), Output_ch5+ (out), Output_ch5- (out), Output_ch6+ (out), Output_ch6- (out), Output_ch7+ (out), Output_ch7- (out), Output_ch8+ (out), Output_ch8- (out), Input_ch1+ (in), Input_ch1- (in), Input_ch2+ (in), Input_ch2- (in), Input_ch3+ (in), Input_ch3- (in), Input_ch4+ (in), Input_ch4- (in), Input_ch5+ (in), Input_ch5- (in), Input_ch6+ (in), Input_ch6- (in), Input_ch7+ (in), Input_ch7- (in), Input_ch8+ (in), Input_ch8- (in), CSB (in), SDIO/ODM (bidir), SCLK (in), CLK+ (in), CLK- (in), 26 (in)
Part19 = Digitizer.SchDoc: Output_ch1+ (out), Output_ch1- (out), Output_ch2+ (out), Output_ch2- (out), Output_ch3+ (out), Output_ch3- (out), Output_ch4+ (out), Output_ch4- (out), Output_ch5+ (out), Output_ch5- (out), Output_ch6+ (out), Output_ch6- (out), Output_ch7+ (out), Output_ch7- (out), Output_ch8+ (out), Output_ch8- (out), Input_ch1+ (in), Input_ch1- (in), Input_ch2+ (in), Input_ch2- (in), Input_ch3+ (in), Input_ch3- (in), Input_ch4+ (in), Input_ch4- (in), Input_ch5+ (in), Input_ch5- (in), Input_ch6+ (in), Input_ch6- (in), Input_ch7+ (in), Input_ch7- (in), Input_ch8+ (in), Input_ch8- (in), CSB (in), SDIO/ODM (bidir), SCLK (in), CLK+ (in), CLK- (in), 26 (in)
Part20 = Digitizer.SchDoc: Output_ch1+ (out), Output_ch1- (out), Output_ch2+ (out), Output_ch2- (out), Output_ch3+ (out), Output_ch3- (out), Output_ch4+ (out), Output_ch4- (out), Output_ch5+ (out), Output_ch5- (out), Output_ch6+ (out), Output_ch6- (out), Output_ch7+ (out), Output_ch7- (out), Output_ch8+ (out), Output_ch8- (out), Input_ch1+ (in), Input_ch1- (in), Input_ch2+ (in), Input_ch2- (in), Input_ch3+ (in), Input_ch3- (in), Input_ch4+ (in), Input_ch4- (in), Input_ch5+ (in), Input_ch5- (in), Input_ch6+ (in), Input_ch6- (in), Input_ch7+ (in), Input_ch7- (in), Input_ch8+ (in), Input_ch8- (in), CSB (in), SDIO/ODM (bidir), SCLK (in), CLK+ (in), CLK- (in), 26 (in)
Processing = Processing.SchDoc: Part1_DigCh1+ (in), Part1_DigCh1- (in), Part1_DigCh2+ (in), Part1_DigCh2- (in), Part1_DigCh3+ (in), Part1_DigCh3- (in), Part1_DigCh4+ (in), Part1_DigCh4- (in), Part1_DigCh5+ (in), Part1_DigCh5- (in), Part1_DigCh6+ (in), Part1_DigCh6- (in), Part1_DigCh7+ (in), Part1_DigCh7- (in), Part1_DigCh8+ (in), Part1_DigCh8- (in), Part2_DigCh1+ (in), Part2_DigCh1- (in), Part2_DigCh2+ (in), Part2_DigCh2- (in), Part2_DigCh3+ (in), Part2_DigCh3- (in), Part2_DigCh4+ (in), Part2_DigCh4- (in), Part2_DigCh5+ (in), Part2_DigCh5- (in), Part2_DigCh6+ (in), Part2_DigCh6- (in), Part2_DigCh7+ (in), Part2_DigCh7- (in), Part2_DigCh8+ (in), Part2_DigCh8- (in), Part3_DigCh1+ (in), Part3_DigCh1- (in), Part3_DigCh2+ (in), Part3_DigCh2- (in), Part3_DigCh3+ (in), Part3_DigCh3- (in), Part3_DigCh4+ (in), Part3_DigCh4- (in), Part3_DigCh5+ (in), Part3_DigCh5- (in), Part3_DigCh6+ (in), Part3_DigCh6- (in), Part3_DigCh7+ (in), Part3_DigCh7- (in), Part3_DigCh8+ (in), Part3_DigCh8- (in), Part4_DigCh1+ (in), Part4_DigCh1- (in), Part4_DigCh2+ (in), Part4_DigCh2- (in), Part4_DigCh3+ (in), Part4_DigCh3- (in), Part4_DigCh4+ (in), Part4_DigCh4- (in), Part4_DigCh5+ (in), Part4_DigCh5- (in), Part4_DigCh6+ (in), Part4_DigCh6- (in), Part4_DigCh7+ (in), Part4_DigCh7- (in), Part4_DigCh8+ (in), Part4_DigCh8- (in), Part5_DigCh1+ (in), Part5_DigCh1- (in), Part5_DigCh2+ (in), Part5_DigCh2- (in), Part5_DigCh3+ (in), Part5_DigCh3- (in), Part5_DigCh4+ (in), Part5_DigCh4- (in), Part5_DigCh5+ (in), Part5_DigCh5- (in), Part5_DigCh6+ (in), Part5_DigCh6- (in), Part5_DigCh7+ (in), Part5_DigCh7- (in), Part5_DigCh8+ (in), Part5_DigCh8- (in), Part6_DigCh1+ (in), Part6_DigCh1- (in), Part6_DigCh2+ (in), Part6_DigCh2- (in), Part6_DigCh3+ (in), Part6_DigCh3- (in), Part6_DigCh4+ (in), Part6_DigCh4- (in), Part6_DigCh5+ (in), Part6_DigCh5- (in), Part6_DigCh6+ (in), Part6_DigCh6- (in), Part6_DigCh7+ (in), Part6_DigCh7- (in), Part6_DigCh8+ (in), Part6_DigCh8- (in), Part7_DigCh1+ (in), Part7_DigCh1- (in), Part7_DigCh2+ (in), Part7_DigCh2- (in), Part7_DigCh3+ (in), Part7_DigCh3- (in), Part7_DigCh4+ (in), Part7_DigCh4- (in), Part7_DigCh5+ (in), Part7_DigCh5- (in), Part7_DigCh6+ (in), Part7_DigCh6- (in), Part7_DigCh7+ (in), Part7_DigCh7- (in), Part7_DigCh8+ (in), Part7_DigCh8- (in), Part8_DigCh1+ (in), Part8_DigCh1- (in), Part8_DigCh2+ (in), Part8_DigCh2- (in), Part8_DigCh3+ (in), Part8_DigCh3- (in), Part8_DigCh4+ (in), Part8_DigCh4- (in), Part8_DigCh5+ (in), Part8_DigCh5- (in), Part8_DigCh6+ (in), Part8_DigCh6- (in), Part8_DigCh7+ (in), Part8_DigCh7- (in), Part8_DigCh8+ (in), Part8_DigCh8- (in), Part9_DigCh1+ (in), Part9_DigCh1- (in), Part9_DigCh2+ (in), Part9_DigCh2- (in), Part9_DigCh3+ (in), Part9_DigCh3- (in), Part9_DigCh4+ (in), Part9_DigCh4- (in), Part9_DigCh5+ (in), Part9_DigCh5- (in), Part9_DigCh6+ (in), Part9_DigCh6- (in), Part9_DigCh7+ (in), Part9_DigCh7- (in), Part9_DigCh8+ (in), Part9_DigCh8- (in), Part10_DigCh1+ (in), Part10_DigCh1- (in), Part10_DigCh2+ (in), Part10_DigCh2- (in), Part10_DigCh3+ (in), Part10_DigCh3- (in), Part10_DigCh4+ (in), Part10_DigCh4- (in), Part10_DigCh5+ (in), Part10_DigCh5- (in), Part10_DigCh6+ (in), Part10_DigCh6- (in), Part10_DigCh7+ (in), Part10_DigCh7- (in), Part10_DigCh8+ (in), Part10_DigCh8- (in), Part11_DigCh1+ (in), Part11_DigCh1- (in), Part11_DigCh2+ (in), Part11_DigCh2- (in), Part11_DigCh3+ (in), Part11_DigCh3- (in), Part11_DigCh4+ (in), Part11_DigCh4- (in), Part11_DigCh5+ (in), Part11_DigCh5- (in), Part11_DigCh6+ (in), Part11_DigCh6- (in), Part11_DigCh7+ (in), Part11_DigCh7- (in), Part11_DigCh8+ (in), Part11_DigCh8- (in), Part12_DigCh1+ (in), Part12_DigCh1- (in), Part12_DigCh2+ (in), Part12_DigCh2- (in), Part12_DigCh3+ (in), Part12_DigCh3- (in), Part12_DigCh4+ (in), Part12_DigCh4- (in), Part12_DigCh5+ (in), Part12_DigCh5- (in), Part12_DigCh6+ (in), Part12_DigCh6- (in), Part12_DigCh7+ (in), Part12_DigCh7- (in), Part12_DigCh8+ (in), Part12_DigCh8- (in), Part13_DigCh1+ (in), Part13_DigCh1- (in), Part13_DigCh2+ (in), Part13_DigCh2- (in), Part13_DigCh3+ (in), Part13_DigCh3- (in), Part13_DigCh4+ (in), Part13_DigCh4- (in), Part13_DigCh5+ (in), Part13_DigCh5- (in), Part13_DigCh6+ (in), Part13_DigCh6- (in), Part13_DigCh7+ (in), Part13_DigCh7- (in), Part13_DigCh8+ (in), Part13_DigCh8- (in), Part14_DigCh1+ (in), Part14_DigCh1- (in), Part14_DigCh2+ (in), Part14_DigCh2- (in), Part14_DigCh3+ (in), Part14_DigCh3- (in), Part14_DigCh4+ (in), Part14_DigCh4- (in), Part14_DigCh5+ (in), Part14_DigCh5- (in), Part14_DigCh6+ (in), Part14_DigCh6- (in), Part14_DigCh7+ (in), Part14_DigCh7- (in), Part14_DigCh8+ (in), Part14_DigCh8- (in), Part15_DigCh1+ (in), Part15_DigCh1- (in), Part15_DigCh2+ (in), Part15_DigCh2- (in), Part15_DigCh3+ (in), Part15_DigCh3- (in), Part15_DigCh4+ (in), Part15_DigCh4- (in), Part15_DigCh5+ (in), Part15_DigCh5- (in), Part15_DigCh6+ (in), Part15_DigCh6- (in), Part15_DigCh7+ (in), Part15_DigCh7- (in), Part15_DigCh8+ (in), Part15_DigCh8- (in), Part16_DigCh1+ (in), Part16_DigCh1- (in), Part16_DigCh2+ (in), Part16_DigCh2- (in), Part16_DigCh3+ (in), Part16_DigCh3- (in), Part16_DigCh4+ (in), Part16_DigCh4- (in), Part16_DigCh5+ (in), Part16_DigCh5- (in), Part16_DigCh6+ (in), Part16_DigCh6- (in), Part16_DigCh7+ (in), Part16_DigCh7- (in), Part16_DigCh8+ (in), Part16_DigCh8- (in), Part17_DigCh1+ (in), Part17_DigCh1- (in), Part17_DigCh2+ (in), Part17_DigCh2- (in), Part17_DigCh3+ (in), Part17_DigCh3- (in), Part17_DigCh4+ (in), Part17_DigCh4- (in), Part17_DigCh5+ (in), Part17_DigCh5- (in), Part17_DigCh6+ (in), Part17_DigCh6- (in), Part17_DigCh7+ (in), Part17_DigCh7- (in), Part17_DigCh8+ (in), Part17_DigCh8- (in), Part18_DigCh1+ (in), Part18_DigCh1- (in), Part18_DigCh2+ (in), Part18_DigCh2- (in), Part18_DigCh3+ (in), Part18_DigCh3- (in), Part18_DigCh4+ (in), Part18_DigCh4- (in), Part18_DigCh5+ (in), Part18_DigCh5- (in), Part18_DigCh6+ (in), Part18_DigCh6- (in), Part18_DigCh7+ (in), Part18_DigCh7- (in), Part18_DigCh8+ (in), Part18_DigCh8- (in), Part19_DigCh1+ (in), Part19_DigCh1- (in), Part19_DigCh2+ (in), Part19_DigCh2- (in), Part19_DigCh3+ (in), Part19_DigCh3- (in), Part19_DigCh4+ (in), Part19_DigCh4- (in), Part19_DigCh5+ (in), Part19_DigCh5- (in), Part19_DigCh6+ (in), Part19_DigCh6- (in), Part19_DigCh7+ (in), Part19_DigCh7- (in), Part19_DigCh8+ (in), Part19_DigCh8- (in), Part20_DigCh1+ (in), Part20_DigCh1- (in), Part20_DigCh2+ (in), Part20_DigCh2- (in), Part20_DigCh3+ (in), Part20_DigCh3- (in), Part20_DigCh4+ (in), Part20_DigCh4- (in), Part20_DigCh5+ (in), Part20_DigCh5- (in), Part20_DigCh6+ (in), Part20_DigCh6- (in), Part20_DigCh7+ (in), Part20_DigCh7- (in), Part20_DigCh8+ (in), Part20_DigCh8- (in)
Ref_Supply = Supply.SchDoc: no entries